# EAGLE design STorM32 NT logger v12 (EAGLE 7.5.0)
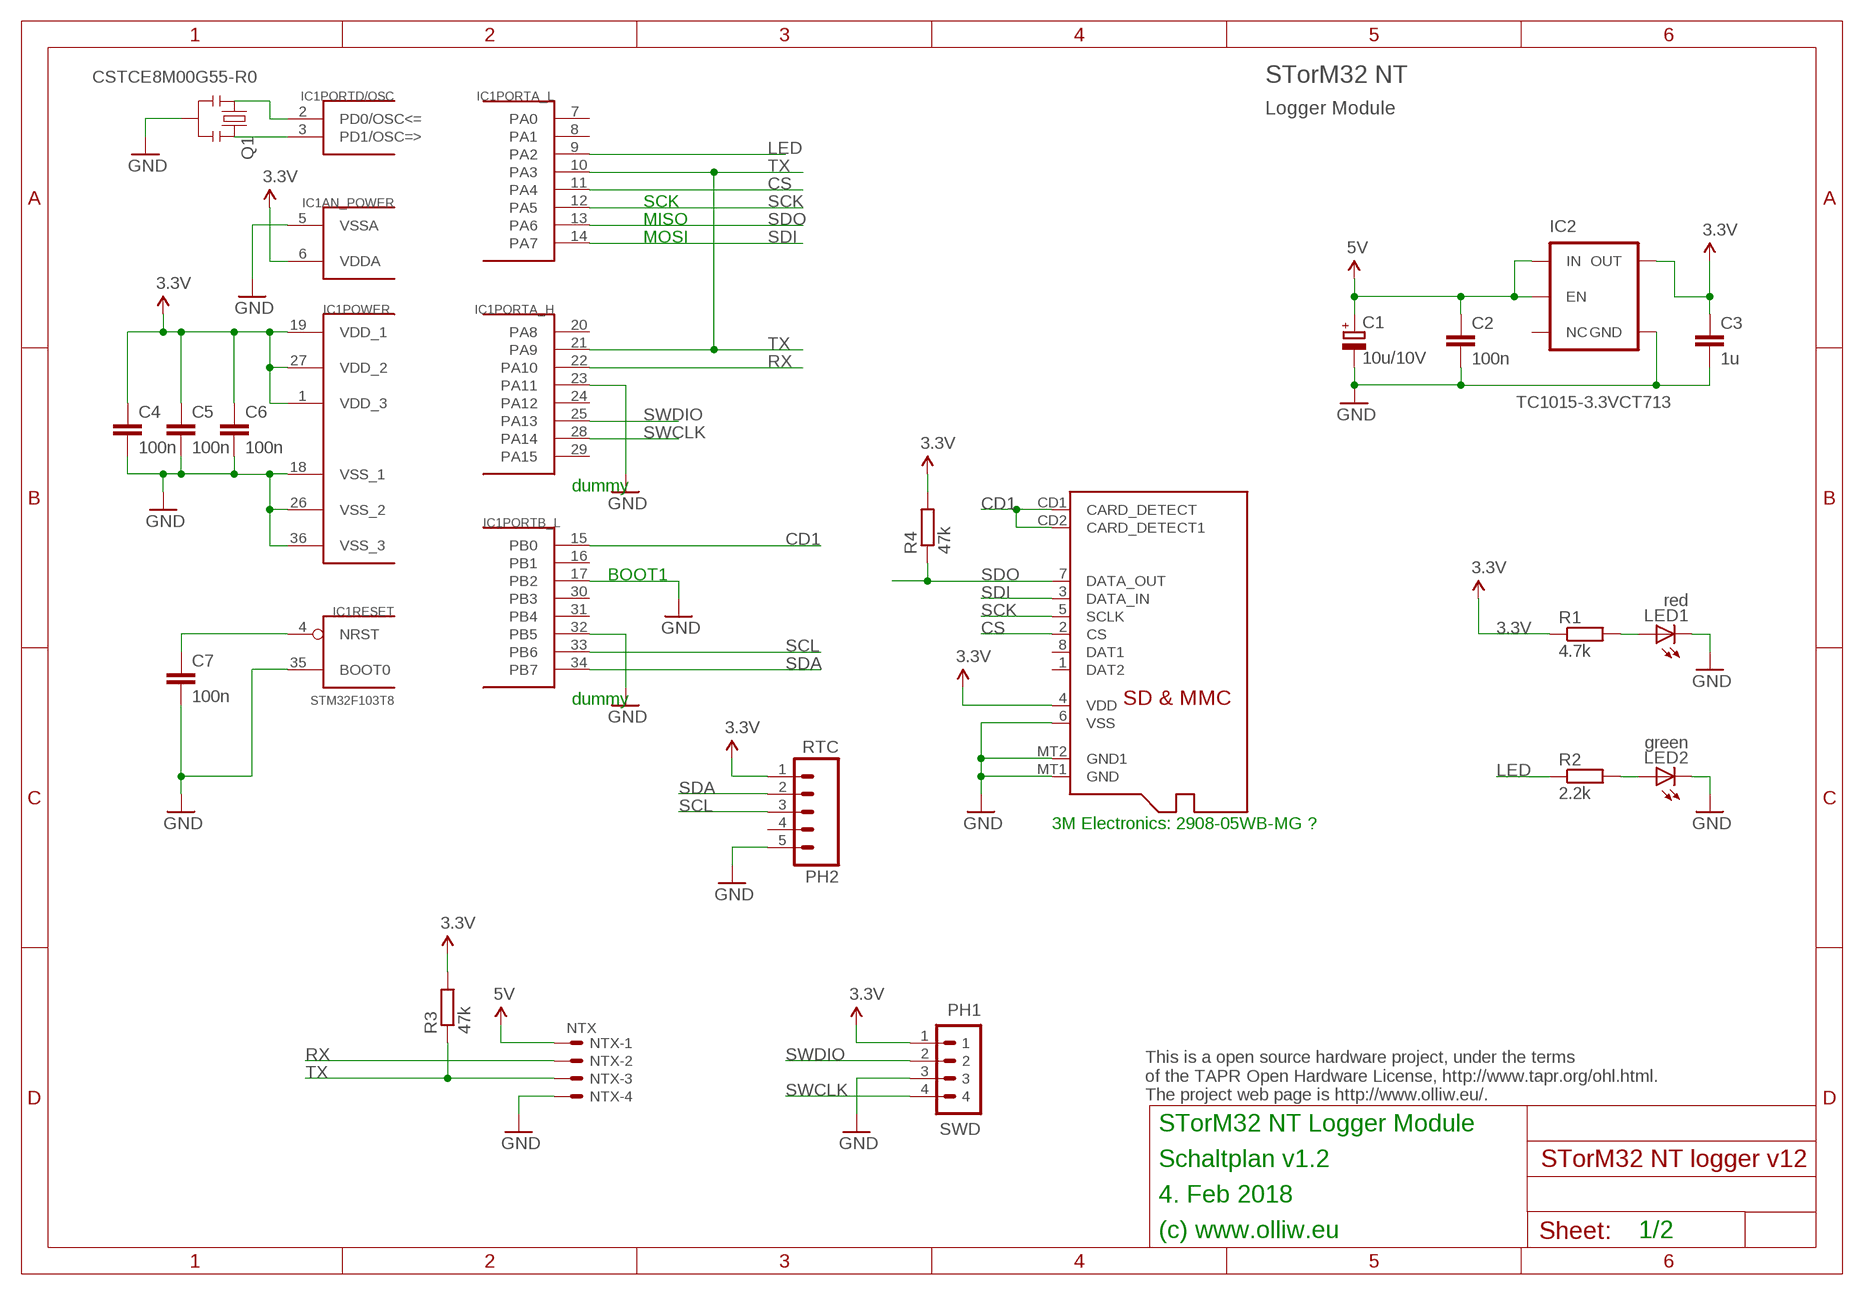
[diagram p0: schematic, sheet 1]

## Parts
C1  10u/10V  CPOL-EUSMCB  [SMC_B]
C2  100n  C-EUC0603  [C0603]
C3  1u  C-EUC0603  [C0603]
C4  100n  C-EUC0603  [C0603]
C5  100n  C-EUC0603  [C0603]
C6  100n  C-EUC0603  [C0603]
C7  100n  C-EUC0603  [C0603]
IC1  STM32F103T8  STM32F10XTXU6  [VFQFPN36]
IC2  TC1015-3.3VCT713  V_REG_TPS76433SOT23-5  [SOT23-5]
LED1  red  LEDCHIPLED_0603  [CHIPLED_0603]
LED2  green  LEDCHIPLED_0603  [CHIPLED_0603]
NTX  NTX  SM04B-SRSS-TB  [SM04B-SRSS-TB]
PH1  SWD  P4X1_1P27-OCT_BILEX  [4X1_1P27_OCT_BILEX]
PH2  RTC  M05PTH  [1X05]
Q1  CSTCE8M00G55-R0  RESONATORSMD  [RESONATOR-SMD]
R1  4.7k  R-EU_R0603  [R0603]
R2  2.2k  R-EU_R0603  [R0603]
R3  47k  R-EU_R0603  [R0603]
R4  47k  R-EU_R0603  [R0603]
U1  3M 2908-05WB-MG ??  MICROSD  [MICROSD]

## Nets
3.3V: C3.1 C4.1 C5.1 C6.1 IC1.1(POWER:VDD_3) IC1.6(AN_POWER:VDDA) IC1.19(POWER:VDD_1) IC1.27(POWER:VDD_2) IC2.5(OUT) PH1.1 PH2.1 R1.1 R3.2 R4.2 U1.4(VDD)
5V: C1.+ C2.1 IC2.1(IN) IC2.3(EN) NTX.1
CD1: IC1.15(PORTB_L:PB0) U1.CD1(CARD_DETECT) U1.CD2(CARD_DETECT1)
CS: IC1.11(PORTA_L:PA4) U1.2(CS)
GND: C1.- C2.2 C3.2 C4.2 C5.2 C6.2 C7.2 IC1.5(AN_POWER:VSSA) IC1.17(PORTB_L:PB2) IC1.18(POWER:VSS_1) IC1.23(PORTA_H:PA11) IC1.26(POWER:VSS_2) IC1.32(PORTB_L:PB5) IC1.35(RESET:BOOT0) IC1.36(POWER:VSS_3) IC2.2(GND) LED1.C LED2.C NTX.4 PH1.3 PH2.5 Q1.2 U1.6(VSS) U1.MT1(GND) U1.MT2(GND1)
LED: IC1.9(PORTA_L:PA2) R2.1
N$1: C7.1 IC1.4(RESET:NRST)
N$2: LED2.A R2.2
N$5: IC1.2(PORTD/OSC:PD0/OSC<=) Q1.1
N$6: IC1.3(PORTD/OSC:PD1/OSC=>) Q1.3
N$9: LED1.A R1.2
RX: IC1.22(PORTA_H:PA10) NTX.2
SCK: IC1.12(PORTA_L:PA5) U1.5(SCLK)
SCL: IC1.33(PORTB_L:PB6) PH2.3
SDA: IC1.34(PORTB_L:PB7) PH2.2
SDI: IC1.14(PORTA_L:PA7) U1.3(DATA_IN)
SDO: IC1.13(PORTA_L:PA6) R4.1 U1.7(DATA_OUT)
SWCLK: IC1.28(PORTA_H:PA14) PH1.4
SWDIO: IC1.25(PORTA_H:PA13) PH1.2
TX: IC1.10(PORTA_L:PA3) IC1.21(PORTA_H:PA9) NTX.3 R3.1
Unconnected: IC1.7(PORTA_L:PA0) IC1.8(PORTA_L:PA1) IC1.16(PORTB_L:PB1) IC1.20(PORTA_H:PA8) IC1.24(PORTA_H:PA12) IC1.29(PORTA_H:PA15) IC1.30(PORTB_L:PB3) IC1.31(PORTB_L:PB4) IC2.4(NC) PH2.4 U1.1(DAT2) U1.8(DAT1)

## Notes on the sheet
- STorM32 NT
- Logger Module
- SCK
- MISO
- MOSI
- dummy
- BOOT1
- dummy
- 3M Electronics: 2908-05WB-MG ?
- This is a open source hardware project, under the terms
  of the TAPR Open Hardware License, http://www.tapr.org/ohl.html.
  The project web page is http://www.olliw.eu/.
- STorM32 NT Logger Module
- Schaltplan v1.2
- 4. Feb 2018
- (c) www.olliw.eu | 1/2

## Library data of the parts
C1 = rcl:CPOL-EU: POLARIZED CAPACITOR, European symbol
C2-C7 = rcl:C-EU: CAPACITOR, European symbol
IC1 = # stm32:STM32F10XTXU6: STM32F101/103 36pad VFQPFN36
IC2 = # SparkFun2:V_REG_TPS76433: Voltage Regulator Older TI part. LDO 150mA regulator. No output by-pass cap option. See V_REG_LDO for a better part.
LED1 LED2 = led:LED: LED OSRAM: - CHIPLED LG R971, LG N971, LY N971, LG Q971, LY Q971, LO R971, LY R971 LH N974, LH R974 LS Q976, LO Q976, LY Q976 LO Q996 - Hyper CHIPLED LW Q18S LB Q993, LB Q99A, LB R99A - SideLED LS A670, LO A670, LY A670, LG A670, LP A670 LB A673, LV A673, LT A673, LW A673 LH A674 LY A675 LS A676, LA A676, LO A676, LY A676, LW A676 LS A679, LY A679, LG A679 - Hyper Micro SIDELED® LS Y876, LA Y876, LO Y876, LY Y876 LT Y87S - SmartLED LW L88C, LW L88S LB L89C, LB L89S, LG L890 LS L89K, LO L89K, LY L89K LS L896, LA L896, LO L896, LY L896 - TOPLED LS T670, LO T670, LY T670, LG T670, LP T670 LSG T670, LSP T670, LSY T670, LOP T670, LYG T670 LG T671, LOG T671, LSG T671 LB T673, LV T673, LT T673, LW T673 LH T674 LS T676, LA T676, LO T676, LY T676, LB T676, LH T676, LSB T676, LW T676 LB T67C, LV T67C, LT T67C, LS T67K, LO T67K, LY T67K, LW E67C LS E67B, LA E67B, LO E67B, LY E67B, LB E67C, LV E67C, LT E67C LW T67C LS T679, LY T679, LG T679 LS T770, LO T770, LY T770, LG T770, LP T770 LB T773, LV T773, LT T773, LW T773 LH T774 LS E675, LA E675, LY E675, LS T675 LS T776, LA T776, LO T776, LY T776, LB T776 LHGB T686 LT T68C, LB T68C - Hyper Mini TOPLED® LB M676 - Mini TOPLED Santana® LG M470 LS M47K, LO M47K, LY M47K Source: http://www.osram.convergy.de LUXEON: - LUMILED® LXK2-PW12-R00, LXK2-PW12-S00, LXK2-PW14-U00, LXK2-PW14-V00 LXK2-PM12-R00, LXK2-PM12-S00, LXK2-PM14-U00 LXK2-PE12-Q00, LXK2-PE12-R00, LXK2-PE12-S00, LXK2-PE14-T00, LXK2-PE14-U00 LXK2-PB12-K00, LXK2-PB12-L00, LXK2-PB12-M00, LXK2-PB14-N00, LXK2-PB14-P00, LXK2-PB14-Q00 LXK2-PR12-L00, LXK2-PR12-M00, LXK2-PR14-Q00, LXK2-PR14-R00 LXK2-PD12-Q00, LXK2-PD12-R00, LXK2-PD12-S00 LXK2-PH12-R00, LXK2-PH12-S00 LXK2-PL12-P00, LXK2-PL12-Q00, LXK2-PL12-R00 Source: www.luxeon.com KINGBRIGHT: KA-3528ASYC Source: www.kingbright.com
NTX = con-jst2:?M04B-SRSS-TB: Disconnectable Crimp style connector, 1.0mm pitch 4 contacts
PH1 = # stdlib:P4X1_1P27
PH2 = # SparkFun2:M05: Header 5 Standard 5-pin 0.1" header. Use with straight break away headers (SKU : PRT-00116), right angle break away headers (PRT-00553), swiss pins (PRT-00743), machine pins (PRT-00117), and female headers (PRT-00115). Molex polarized connector foot print use with SKU : PRT-08230 with associated crimp pins and housings.
Q1 = # SparkFun2:RESONATOR: Resonator Small SMD resonator. This is the itty bitty 10/20MHz resonators with built in caps. CSTCE10M0G55 and CSTCE20M0V53. Footprint has been reviewed closely but hasn't been tested yet.
R1-R4 = rcl:R-EU_: RESISTOR, European symbol
U1 = # adafruit:MICROSD: Micro-SD / Transflash card holder with SPI pinout For the 3M # 2908-05WB-MG and/or 4UCON #19656 push-push type

## Board
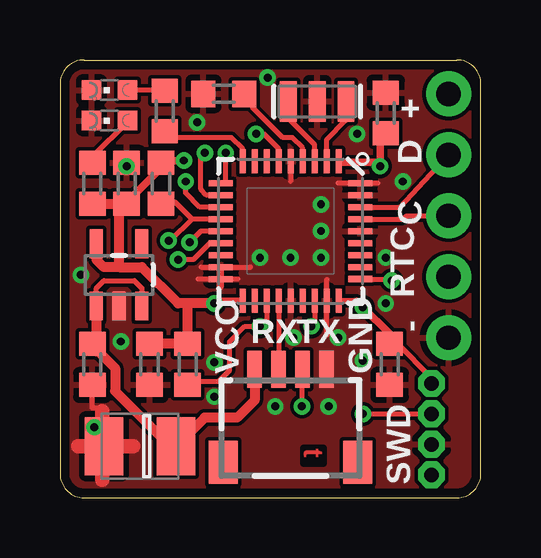
[diagram p1: board, top side]
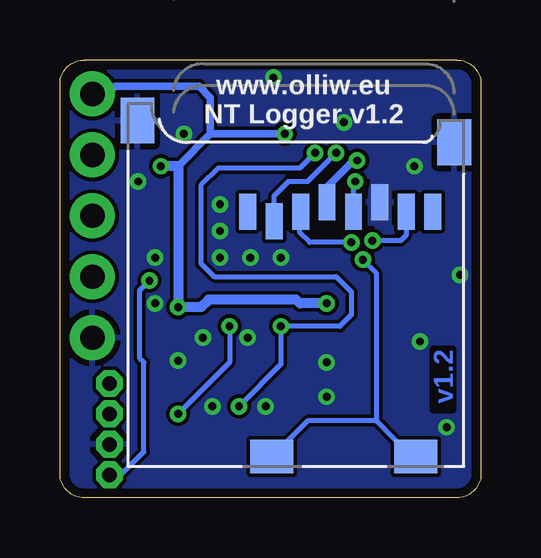
[diagram p2: board, bottom side, seen from below]

Size 17.54 x 18.24 mm. Coordinates in mm from the lower left corner, seen from the top.
Outline: 1,18.24 16.54,18.24 arc-90 17.54,17.24 17.54,1 arc-90 16.54,0 1,0 arc-90 0,1 0,17.24 arc-90 1,18.24
Copper layers (1*16): Top 0.0356mm / dielectric 1.5011mm / Bottom 0.0356mm
Design rules "ow-oshpark-2layer": minimum track width 6mil, minimum drill 13mil, track to track 6mil, track to pad 6mil, pad to pad 6mil, via to via 6mil, smd to smd 6mil, copper to edge 15mil, drill to drill 6mil, minimum pad ring 7mil, minimum via ring 7mil, stop-mask expansion 2.5mil, vias tented up to drill 26mil, thermal gap 10mil

### Footprints (pad centres in the part's own frame; a part is rotated, then mirrored left to right if it is on the bottom)
SMC_B = smd 1.6 x 2.4: + -1.5,0; - 1.5,0
C0603 = smd 1 x 1.1: 1 -0.85,0; 2 0.85,0
VFQFPN36 = smd 1 x 0.25: 1 -2.9,2; 2 -2.9,1.5; 3 -2.9,1; 4 -2.9,0.5; 5 -2.9,0; 6 -2.9,-0.5; 7 -2.9,-1; 8 -2.9,-1.5; 9 -2.9,-2; 19 2.9,-2; 20 2.9,-1.5; 21 2.9,-1; 22 2.9,-0.5; 23 2.9,0; 24 2.9,0.5; 25 2.9,1; 26 2.9,1.5; 27 2.9,2 | smd 0.25 x 1: 10 -2,-2.9; 11 -1.5,-2.9; 12 -1,-2.9; 13 -0.5,-2.9; 14 0,-2.9; 15 0.5,-2.9; 16 1,-2.9; 17 1.5,-2.9; 18 2,-2.9; 29 1.5,2.9; 30 1,2.9; 31 0.5,2.9; 32 0,2.9; 33 -0.5,2.9; 34 -1,2.9; 35 -1.5,2.9; 36 -2,2.9 | smd 0.27 x 1: 28 2,2.9
SOT23-5 = smd 0.55 x 1.2: 1 -0.95,-1.3; 2 0,-1.3; 3 0.95,-1.3; 4 0.95,1.3; 5 -0.95,1.3
CHIPLED_0603 = smd 0.8 x 0.8: A 0,-0.75; C 0,0.75
SM04B-SRSS-TB = smd 0.6 x 1.55: 1 -1.5,2.975; 2 -0.5,2.975; 3 0.5,2.975; 4 1.5,2.975 | smd 1.2 x 1.8: FIT@1 -2.8,-0.9; FIT@2 2.8,-0.9
4X1_1P27_OCT_BILEX = drill 0.61 pad 1.118 octagon: 1 0,0; 2 0,-1.27; 3 0,-2.54; 4 0,-3.81
1X05 = drill 1.016 pad 1.88: 1 0,0; 2 2.54,0; 3 5.08,0; 4 7.62,0; 5 10.16,0
RESONATOR-SMD = smd 0.7 x 1.7: 1 -1.2,0; 2 0,0; 3 1.2,0
R0603 = smd 1 x 1.1: 1 -0.85,0; 2 0.85,0
MICROSD = smd 0.7 x 1.5: 1 9,-10.64; 2 7.9,-10.24; 3 6.8,-10.64; 4 5.7,-11.04; 5 4.6,-10.64; 6 3.5,-11.04; 7 2.4,-10.64; 8 1.3,-10.64 | smd 1.8 x 1.4: CD1 2,-0.44; CD2 8,-0.44 | smd 1.4 x 1.9: MT1 0.4,-13.54; MT2 13.6,-14.44

### Placement (x,y rotation side)
C1  3.33,2.14 180 top
C2  1.35,5.56 270 top
C3  3.73,5.56 270 top
C4  13.57,16.03 90 top
C5  2.78,13.1 90 top
C6  13.73,5.56 270 top
C7  6.83,16.83 180 top
IC1  9.6,11.11 270 top
IC2  2.46,9.29 0 top
LED1  2.06,15.72 90 top
LED2  2.06,16.99 90 top
NTX  9.6,2.38 0 top
PH1  15.48,4.76 0 top
PH2  16.19,16.83 270 top
Q1  10.72,16.51 180 top
R1  1.35,13.1 90 top
R2  4.37,16.11 90 top
R3  5.32,5.56 90 top
R4  4.21,13.1 90 top
U1  0.71,1.27 180 bottom

### Tracks (layer width: path | path; a pad name or v marks a point on that pad's centre or on a via)
3.3V  (via drill 0.33)
  Top 0.152: IC2.5 1.54,10.64 | IC1.1 11.65,13.97
  Top 0.203: IC1.6 9.1,14.55 8.49,15.16 v8.18,15.16 | 4.29,13.81 4.29,13.97 4.23,14.03 R4.2 4.26,13.97 | PH1.1 15.48,5 14.07,6.41 C6.1
  Top 0.254: IC1.27 12.35,8.21 v12.62,7.94 | IC1.19 6.55,8.21 v6.43,8.1
  Top 0.305: 2.72,12.25 4.29,13.81 | v12.62,7.94 13.73,6.83 C6.1 | 11.65,13.97 13.18,13.97 v13.34,13.81 13.34,14.92 13.57,14.92 C4.1 | v5.16,14.05 4.45,14.05 4.37,13.97 4.26,13.97
  Top 0.406: IC2.5 1.51,9.92 1.83,9.6 2.46,9.6 | C3.1 R3.2 5.32,8.1 | R1.1 2.46,12.25 | 2.46,12.25 2.72,12.25 C5.1 | 2.46,9.6 3.41,9.6 4.92,8.1 5.32,8.1 | 2.46,9.6 2.46,12.25 | v6.43,8.1 5.32,8.1
  Bottom 0.305: U1.4 6.41,12.95 5.32,14.05 v5.16,14.05 | 12.62,13.81 11.27,15.16 | 11.27,15.16 v8.18,15.16 | PH2.1 15.56,16.83 15.24,17.14 11.75,17.14 11.27,16.67 11.27,15.16
  Bottom 0.406: v6.43,8.1 7.54,8.1 7.7,8.26 11.35,8.26 11.67,7.94 v12.62,7.94 12.62,13.81 v13.34,13.81
5V
  Top 0.152: 1.61,6.09 C2.1 1.51,6.09 | 3.41,8.07 IC2.3
  Top 0.203: IC2.1 1.51,8.73 1.83,9.05 3.1,9.05 3.41,8.73 3.41,8.07
  Top 0.406: NTX.1 8.1,4.06 7.38,3.33 6.02,3.33 C1.+ 4.21,2.54 2.3,4.45 2.3,5.4 1.61,6.09 | IC2.1 1.51,6.09
CD1  (via drill 0.33)
  Top 0.203: IC1.15 6.25,10.61 5.56,9.92 v4.92,9.92
  Bottom 0.152: 8.97,1.81 U1.CD2 | 2.94,1.75 2.78,1.39 U1.CD1
  Bottom 0.203: v4.92,9.92 4.37,9.37 4.37,3.2 | 4.37,3.2 2.94,1.75 | 4.37,3.2 7.22,3.2 U1.CD2
CS  (via drill 0.33)
  Top 0.203: IC1.11 6.1,12.61 5.87,12.86 5.87,14.21 v6.03,14.37
  Bottom 0.203: U1.2 8.61,12.58 8.02,13.18 7.22,13.18 v6.03,14.37
GND  (via drill 0.33 pad 0.61)
  Top 0.152: IC1.17 6.7,9.48 6.67,9.45 | 12.66,13.17 IC1.36
  Top 0.203: 9.6,14.45 9.6,13.18 | 13.26,13.11 11.59,13.11 | 5.87,9.6 7.94,9.6 | 5.75,9.12 7.42,9.12 | 11.12,6.79 11.12,9.09 | 1.76,3.61 1.75,3.53 1.75,3.73 1.35,3.73 C2.2
  Top 0.305: 6.67,8.81 6.67,9.45
  Top 0.61: 1.76,0.75 1.76,3.61 | 3.06,2.15 0.75,2.15
  other vias: 10.87,11.11 10.87,12.22 9.6,10 10.87,10 2.54,6.51 6.43,5.64 11.19,3.81 8.97,3.81 9.72,6.67 13.57,10 0.87,9.29 1.43,2.94 13.57,8.1 6.43,4.21 12.38,15.16 2.78,13.81 12.62,5.71 5.71,15.64 8.65,17.5 14.29,13.18 11.59,6.67 8.33,10
  pour Bottom (isolate 0.152): 0.41,17.16 arc-90 1.08,17.83 16.62,17.83 arc-90 17.29,17.16 17.29,1 arc-90 16.62,0.33 1.08,0.33 arc-90 0.41,1
  pour Top (isolate 0.152): 0.41,17.16 arc-90 1.08,17.83 16.62,17.83 arc-90 17.29,17.16 17.29,1 arc-90 16.62,0.33 1.08,0.33 arc-90 0.41,1
  pour Top (no thermals): 10.56,6.35 11.83,6.35 11.83,4.13 10.56,4.13
  pour Bottom (isolate 0.254, rank 2, no thermals): 3.73,13.34 3.73,11.27 4.68,11.27 4.68,13.34
  pour Top (no thermals): 1.98,7.14 1.98,8.57 2.14,8.73 2.78,8.73 2.94,8.57 2.94,7.14
LED
  Top 0.203: IC1.9 7.6,14.54 7.14,15 4.76,15 4.52,15.24 4.34,15.24 R2.1
N$1
  Top 0.152: 8.02,16.73 C7.1
  Top 0.203: IC1.4 10.1,14.58 9.68,15 9.29,15 8.02,16.27 8.02,16.73
N$2
  Top 0.152: R2.2 4.1,16.88 4.13,16.99
  Top 0.203: 4.13,16.99 LED2.A
N$5
  Top 0.203: IC1.2 11.1,14.91 11.92,15.73 Q1.1
N$6
  Top 0.203: IC1.3 10.6,14.72 9.44,15.88 Q1.3
N$9
  Top 0.152: 2.86,15.72 LED1.A
  Top 0.203: 2.86,15.72 1.35,14.21 R1.2
RX
  Top 0.152: 9.29,5.22 NTX.2 9.13,5.54
  Top 0.203: IC1.22 9.1,5.82 9.13,5.79 9.13,5.54
SCK  (via drill 0.33)
  Top 0.203: IC1.12 5.83,12.11 5.24,12.7 v5.24,13.18
  Bottom 0.152: 5.48,11.91 U1.5
  Bottom 0.203: v5.24,13.18 5.31,13.09 U1.5
SCL
  Top 0.203: IC1.33 14.31,11.61 14.45,11.75 PH2.3
SDA
  Top 0.203: IC1.34 14.18,12.11 PH2.2
SDI  (via drill 0.33)
  Top 0.203: IC1.14 5.87,11.11 v5.4,10.64
  Bottom 0.152: 7.54,11.88 U1.3
  Bottom 0.203: v5.4,10.64 7.14,10.64 7.54,11.03 7.54,11.88
SDO  (via drill 0.33)
  Top 0.203: 5.5,11.61 4.6,10.72 v4.52,10.72 | R4.1 4.79,12.33 5.5,11.61 | IC1.13 5.5,11.61
  Bottom 0.203: U1.7 3.11,10.94 3.33,10.72 v4.52,10.72
SWCLK  (via drill 0.33)
  Top 0.203: IC1.28 13.72,9.11 v13.81,9.05
  Bottom 0.203: v13.81,9.05 14.21,8.65 14.21,5.79 14.05,5.64 14.05,1.91 15,0.95 PH1.4
SWDIO  (via drill 0.33)
  Top 0.203: v12.62,3.49 PH1.2 | IC1.25 10.6,7.27 v10.48,7.14
  Bottom 0.203: v10.48,7.14 10.48,5.64 v12.62,3.49
TX  (via drill 0.33)
  Top 0.152: IC1.10 6.7,13.06 6.91,13.18 | NTX.3 10.08,5.33
  Top 0.203: IC1.21 8.6,7.41 v8.33,7.14 7.7,7.14 7.06,6.51 7.06,5.32 6.59,4.84 5.45,4.84 R3.1 | 6.91,13.18 v6.91,14.37 | 10.08,5.33 v10.08,3.81
  Bottom 0.203: v10.08,3.81 8.33,5.56 v8.33,7.14 5.87,7.14 5.4,7.62 5.4,8.57 6.03,9.21 11.11,9.21 11.67,9.76 11.67,13.02 10.95,13.73 7.54,13.73 v6.91,14.37

### Text on the board
Top: t
Bottom: v1.2
tNames: + | D | C | RTC | - | RX | TX | VCC | GND | SWD
bNames: www.olliw.eu / NT Logger v1.2